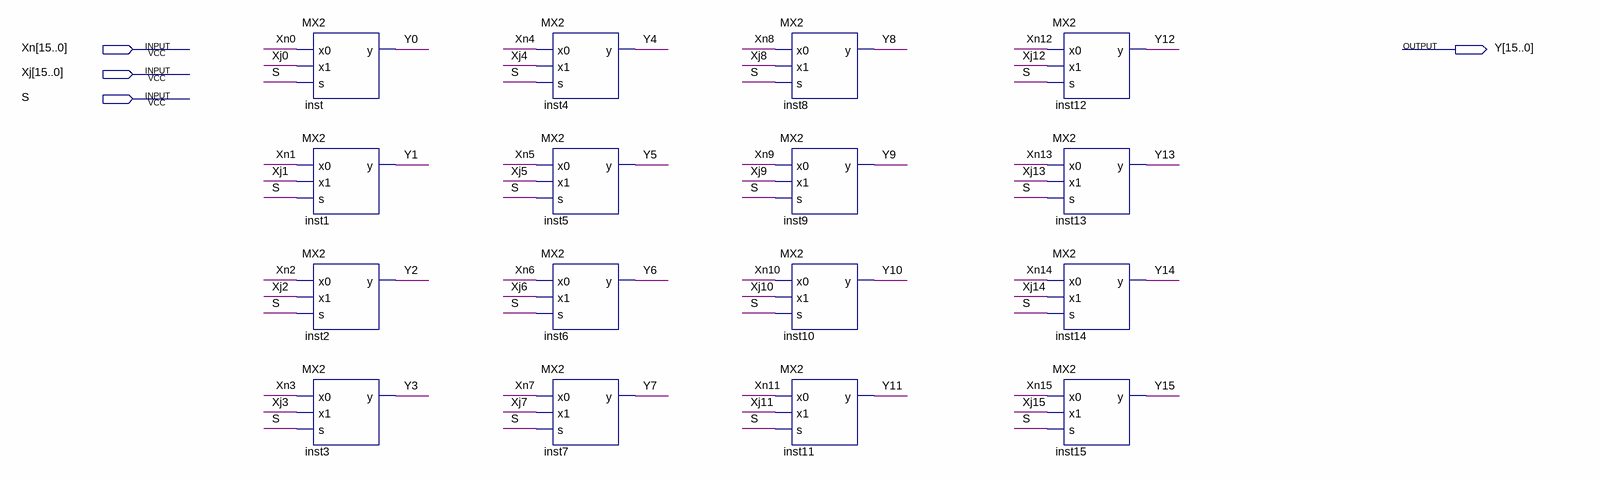
[diagram p0: schematic sheet]
// Quartus schematic MX16.bdf as structural Verilog: 16 symbols, 4 pins
module MX16 (
  input  [15:0] Xn,
  input  [15:0] Xj,
  input  S,
  output [15:0] Y
);

  MX2 inst (.x0(Xn[0]), .x1(Xj[0]), .s(S), .y(Y[0]));
  MX2 inst1 (.x0(Xn[1]), .x1(Xj[1]), .s(S), .y(Y[1]));
  MX2 inst2 (.x0(Xn[2]), .x1(Xj[2]), .s(S), .y(Y[2]));
  MX2 inst3 (.x0(Xn[3]), .x1(Xj[3]), .s(S), .y(Y[3]));
  MX2 inst4 (.x0(Xn[4]), .x1(Xj[4]), .s(S), .y(Y[4]));
  MX2 inst5 (.x0(Xn[5]), .x1(Xj[5]), .s(S), .y(Y[5]));
  MX2 inst6 (.x0(Xn[6]), .x1(Xj[6]), .s(S), .y(Y[6]));
  MX2 inst7 (.x0(Xn[7]), .x1(Xj[7]), .s(S), .y(Y[7]));
  MX2 inst8 (.x0(Xn[8]), .x1(Xj[8]), .s(S), .y(Y[8]));
  MX2 inst9 (.x0(Xn[9]), .x1(Xj[9]), .s(S), .y(Y[9]));
  MX2 inst10 (.x0(Xn[10]), .x1(Xj[10]), .s(S), .y(Y[10]));
  MX2 inst11 (.x0(Xn[11]), .x1(Xj[11]), .s(S), .y(Y[11]));
  MX2 inst12 (.x0(Xn[12]), .x1(Xj[12]), .s(S), .y(Y[12]));
  MX2 inst13 (.x0(Xn[13]), .x1(Xj[13]), .s(S), .y(Y[13]));
  MX2 inst14 (.x0(Xn[14]), .x1(Xj[14]), .s(S), .y(Y[14]));
  MX2 inst15 (.x0(Xn[15]), .x1(Xj[15]), .s(S), .y(Y[15]));
endmodule
